# Altium schematic sheet B293B CoX Amp.SchDoc: CoX Amp
size A4; DocumentNumber: 293; Revision: A
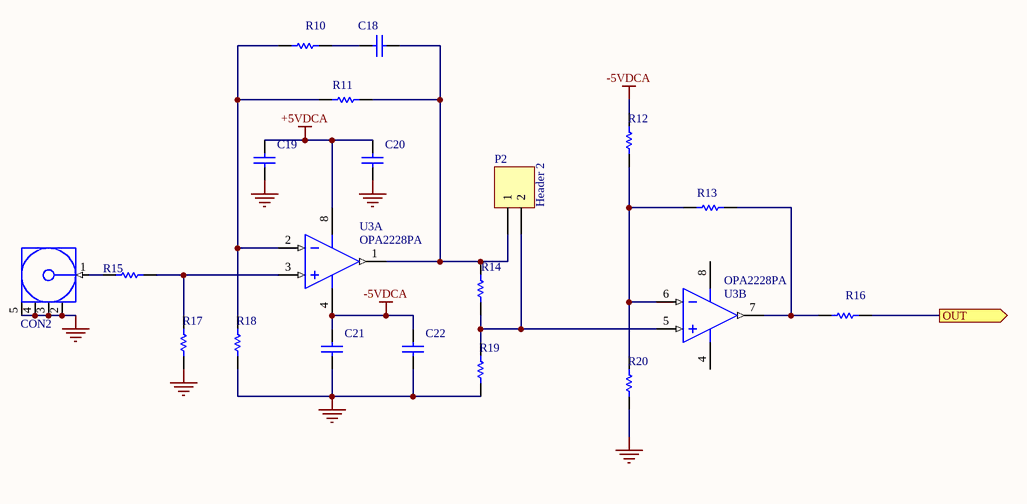
[diagram p0: B293B CoX Amp.SchDoc]

## Parts
C18  CAP 47pF 50V 0805(2012)  [CAPC0805(2012)75_L]  (value not drawn)
C19  CAP 10uF 25V 0805(2012)  [CAPC0805(2012)145_N]  (value not drawn)
C20  CAP 10nF 25V 0805(2012)  [CAPC0805(2012)75_L]  (value not drawn)
C21  CAP 10nF 25V 0805(2012)  [CAPC0805(2012)75_L]  (value not drawn)
C22  CAP 10uF 25V 0805(2012)  [CAPC0805(2012)145_N]  (value not drawn)
CON2  SMA Vertical  [SMA Vertical]  (value not drawn)
P2  Header 2  [HDR1X2]
R10  1K5 5% 0805(2012)  [RESC0805(2012)_L]  (value not drawn)
R11  100K 5% 0805(2012)  [RESC0805(2012)_L]  (value not drawn)
R12  150K 5% 0805(2012)  [RESC0805(2012)_N]  (value not drawn)
R13  10K 5% 0805(2012)  [RESC0805(2012)_L]  (value not drawn)
R14  10K 5% 0805(2012)  [RESC0805(2012)_L]  (value not drawn)
R15  100R 5% 0805(2012)  [RESC0805(2012)_M]  (value not drawn)
R16  100R 5% 0805(2012)  [RESC0805(2012)_M]  (value not drawn)
R17  27K 5% 0805(2012)  [RESC0805(2012)_L]  (value not drawn)
R18  330R 5% 0805(2012)  [RESC0805(2012)_L]  (value not drawn)
R19  1K2 5% 0805(2012)  [RESC0805(2012)_N]  (value not drawn)
R20  1K2 5% 0805(2012)  [RESC0805(2012)_N]  (value not drawn)
U3  OPA2228PA  [TI-P8]  (parts A,B of 2)

## Ports
OUT (out)

## Nets
+5VDCA: C19.2 C20.2 U3.8(V+)
-5VDCA: C21.2 C22.2 R12.2 U3.4(V-)
GND: C19.1 C20.1 C21.1 C22.1 CON2.2(GND) CON2.3(GND) CON2.4(GND) CON2.5(GND) R17.1 R18.1 R19.1 R20.1
OUT: R16.2 ; port OUT
NetC18_1: C18.1 P2.1 R11.2 R14.2 U3.1(OUT_A)
NetC18_2: C18.2 R10.2
NetCON2_1: CON2.1(Signal) R15.2
NetP2_2: P2.2 R14.1 R19.2 U3.5(IN_B+)
NetR10_1: R10.1 R11.1 R18.2 U3.2(IN_A-)
NetR12_1: R12.1 R13.1 R20.2 U3.6(IN_B-)
NetR13_2: R13.2 R16.1 U3.7(OUT_B)
NetR15_1: R15.1 R17.2 U3.3(IN_A+)

## Notes on the sheet
- Title
- Size:
- Date:
- A4
- Number:
- Time:
- Revision:
- Sheet
- of
- Engineer : Matthew Southgate
- Author    : Matthew Southgate
- File:

## Library data of the parts
C18 = CMP-1036-01615-1: CAP 47pF 50V ±5% 0805 (2012 Metric) Thickness 0.75mm SMD; Case-EIA: 0805; Case-Metric: 2012; Technology: SMT; Tolerance: ±5%; Rated Voltage: 50 V; Value: 47pF; Max Thickness: 0.75 mm
C19 C22 = CMP-1036-04933-1: CAP 10uF 25V ±20% 0805 (2012 Metric) Thickness 1.45mm SMD; Case-EIA: 0805; Case-Metric: 2012; Technology: SMT; Tolerance: ±20%; Max Thickness: 1.45 mm; Value: 10uF; Rated Voltage: 25 V
C20 C21 = CMP-1036-03830-1: CAP 10nF 25V ±10% 0805 (2012 Metric) Thickness 0.75mm SMD; Case-Metric: 2012; Case-EIA: 0805; Value: 10nF; Max Thickness: 0.75 mm; Technology: SMT; Rated Voltage: 25 V; Tolerance: ±10%
CON2 = SMA Vertical: Manufacturers Part No: 5-1814832-1; Order Code: 1248990; Supplier: Onecall
P2 = Header 2: Header, 2-Pin; LatestRevisionDate: 17-Jul-2002; LatestRevisionNote: Re-released for DXP Platform.; Publisher: Altium Limited
R10 = CMP-1013-00078-1: 1K5 0.125W 5% 0805 (2012 Metric)  SMD; Case-EIA: 0805; Case-Metric: 2012; Value: 1500.00 Ohm; Tolerance: 5 %; Technology: SMT; Power: 0.125 W
R11 = CMP-1013-00122-1: 100K 0.125W 5% 0805 (2012 Metric)  SMD; Case-EIA: 0805; Value: 100000.00 Ohm; Case-Metric: 2012; Tolerance: 5 %; Technology: SMT; Power: 0.125 W
R12 = CMP-1013-00126-1: 150K 0.125W 5% 0805 (2012 Metric)  SMD; Case-EIA: 0805; Value: 150000.00 Ohm; Case-Metric: 2012; Technology: SMT; Tolerance: 5 %; Power: 0.125 W
R13 R14 = CMP-1013-00098-1: 10K 0.125W 5% 0805 (2012 Metric)  SMD; Case-Metric: 2012; Value: 10000.00 Ohm; Case-EIA: 0805; Technology: SMT; Tolerance: 5 %; Power: 0.125 W
R15 R16 = CMP-1013-00050-1: 100R 0.125W 5% 0805 (2012 Metric)  SMD; Value: 100.00 Ohm; Case-Metric: 2012; Case-EIA: 0805; Technology: SMT; Tolerance: 5 %; Power: 0.125 W
R17 = CMP-1013-00108-1: 27K 0.125W 5% 0805 (2012 Metric)  SMD; Value: 27000.00 Ohm; Case-EIA: 0805; Case-Metric: 2012; Tolerance: 5 %; Technology: SMT; Power: 0.125 W
R18 = CMP-1013-00062-1: 330R 0.125W 5% 0805 (2012 Metric)  SMD; Case-Metric: 2012; Value: 330.00 Ohm; Case-EIA: 0805; Technology: SMT; Tolerance: 5 %; Power: 0.125 W
R19 R20 = CMP-1013-00076-1: 1K2 0.125W 5% 0805 (2012 Metric)  SMD; Case-Metric: 2012; Case-EIA: 0805; Value: 1200.00 Ohm; Technology: SMT; Tolerance: 5 %; Power: 0.125 W
U3 = CMP-0272-01557-2: High Precision, Low Noise Operational Amplifier, 5 to 36 V, -55 to 125 degC, 8-pin DIP (P8), Green (RoHS & no Sb/Br); Manufacturer: Texas Instruments; PackageReference: P8; ComponentLink1Description: Manufacturer URL; ComponentLink1URL: http://www.ti.com/; PackageVersion: 4040082/E, 04/2010; ComponentLink3URL: http://www.ti.com/litv/pdf/mpdi001b; DatasheetVersion: SBOS110A; ComponentLink2URL: http://www.ti.com/lit/ds/symlink/opa2228.pdf; ComponentLink3Description: Package Specification; PackageDescription: 8-Pin Plastic In-Line, Body 9.59 x 6.35 mm, Pitch 2.54 mm; Code_JEDEC: MS-001; ComponentLink2Description: Datasheet